# Altium schematic sheet cell_connector.SchDoc
size Tabloid
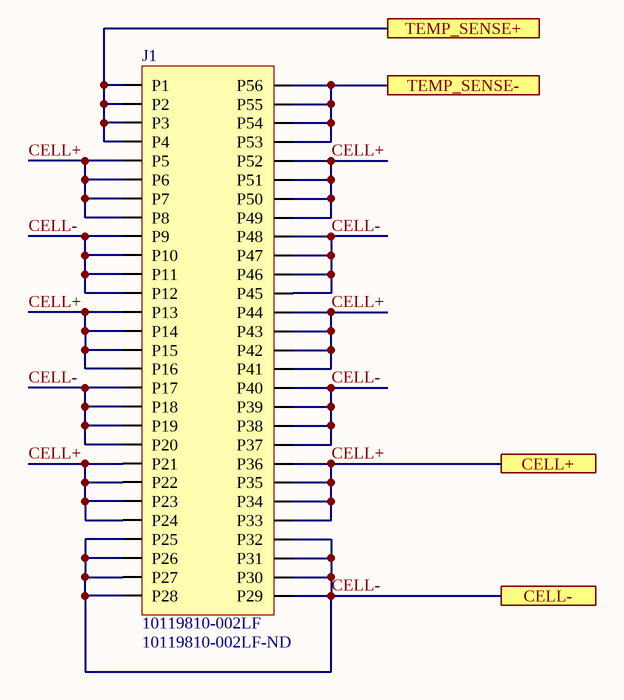
[diagram p0: cell_connector.SchDoc]

## Parts
J1  10119810-002LF  Supplier Part Number 1: 10119810-002LF-ND  [10119810-002LF - Connector]

## Ports
CELL+, CELL-, TEMP_SENSE+, TEMP_SENSE-

## Nets
CELL+: J1.P5 J1.P6 J1.P7 J1.P8 J1.P13 J1.P14 J1.P15 J1.P16 J1.P21 J1.P22 J1.P23 J1.P24 J1.P33 J1.P34 J1.P35 J1.P36 J1.P41 J1.P42 J1.P43 J1.P44 J1.P49 J1.P50 J1.P51 J1.P52 ; port CELL+
CELL-: J1.P9 J1.P10 J1.P11 J1.P12 J1.P17 J1.P18 J1.P19 J1.P20 J1.P25 J1.P26 J1.P27 J1.P28 J1.P29 J1.P30 J1.P31 J1.P32 J1.P37 J1.P38 J1.P39 J1.P40 J1.P45 J1.P46 J1.P47 J1.P48 ; port CELL-
TEMP_SENSE+: J1.P1 J1.P2 J1.P3 J1.P4 ; port TEMP_SENSE+
TEMP_SENSE-: J1.P53 J1.P54 J1.P55 J1.P56 ; port TEMP_SENSE-

## Library data of the parts
J1 = 10119810-002LF - Connector: 56 Position Female Connector Non Specified - Dual Edge Gold or Gold, GXT™  Black; Manufacturer: Amphenol ICC (FCI); Supplier 1: Digi-Key; ComponentLink1Description: https://cdn.amphenol-icc.com/media/wysiwyg/files/drawing/10119810.pdf; ComponentLink1URL: https://cdn.amphenol-icc.com/media/wysiwyg/files/drawing/10119810.pdf; Manufacturer Part Number: 10119810-002LF; Detailed Description: 56 Position Female Connector Non Specified - Dual Edge Gold or Gold, GXT™  Black; System: Connector